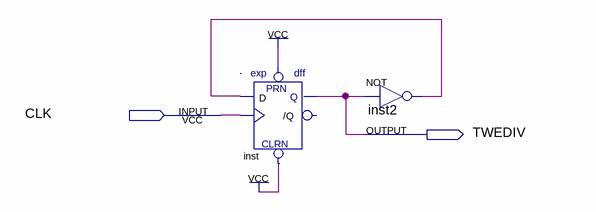
[diagram p0: schematic sheet]
// Quartus schematic 2FENPING.bdf as structural Verilog: 2 symbols, 2 pins
module \2FENPING  (
  input  CLK,
  output TWEDIV
);

  wire inst2_out;

  expdff inst (.CLRN(1'b1), .D(inst2_out), .CLK(CLK), .PRN(1'b1), .Q(TWEDIV));  // open: /Q
  not inst2 (inst2_out, TWEDIV);
endmodule
